# Altium schematic sheet FPGA.schdoc
size 594 x 421 mm; Symbol: Sheet-Symbol_A4; Company: 嘉立创EDA; Version: V1.0; Page Size: A4; @Project Name: prj_extend_and_core_board_7_8; @Page Count: 7; @Update Date: 2024-08-14; @Create Date: 2024-08-09; @Schematic Name: Schematic1; @Page No: 5; @Page Name: FPGA; Device: Sheet-Symbol_A4; @Board Name: Core_Board; @Create Time: 14:20:36; @Update Time: 14:21:04
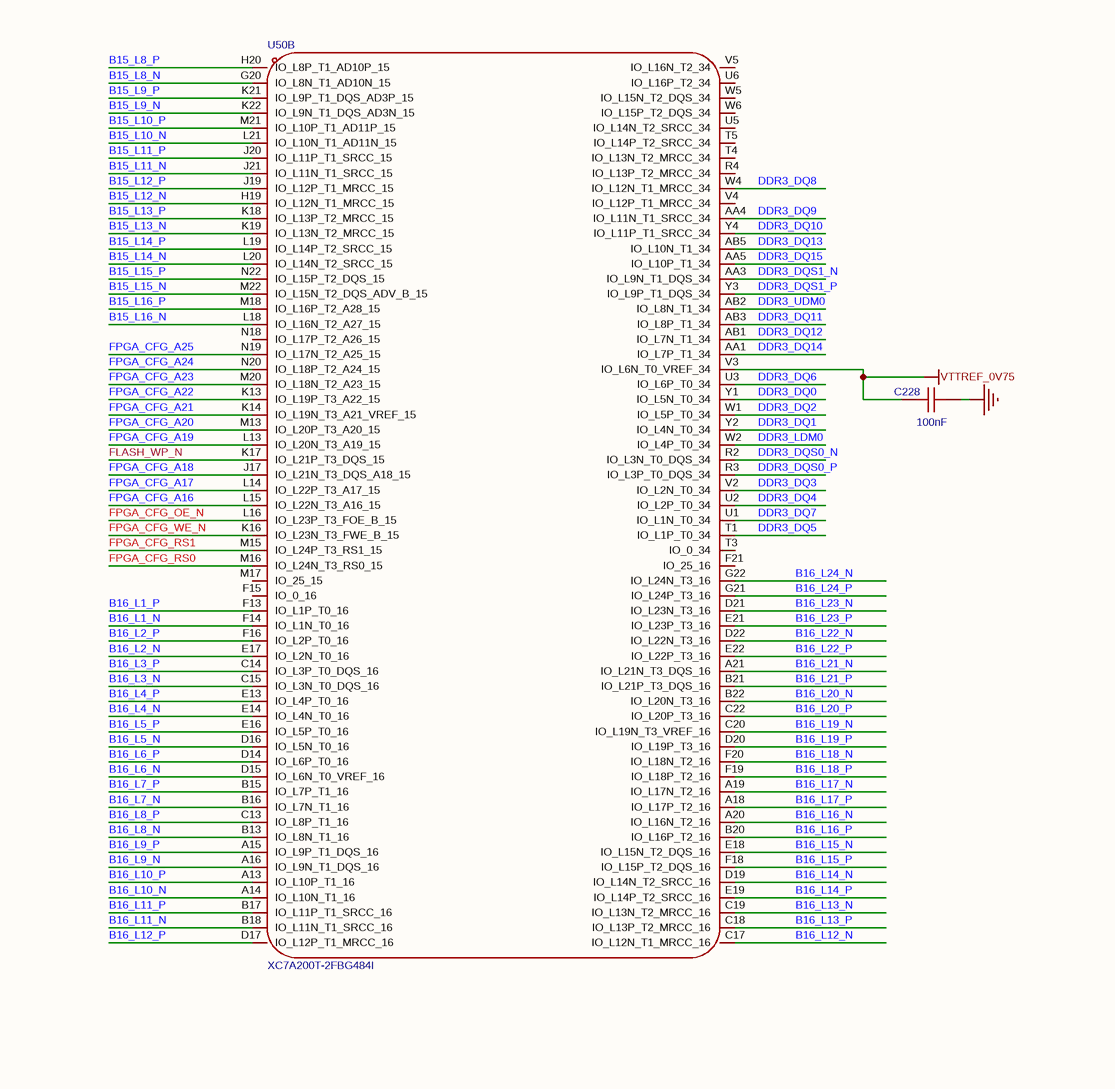
[diagram p0: FPGA.schdoc, top left]
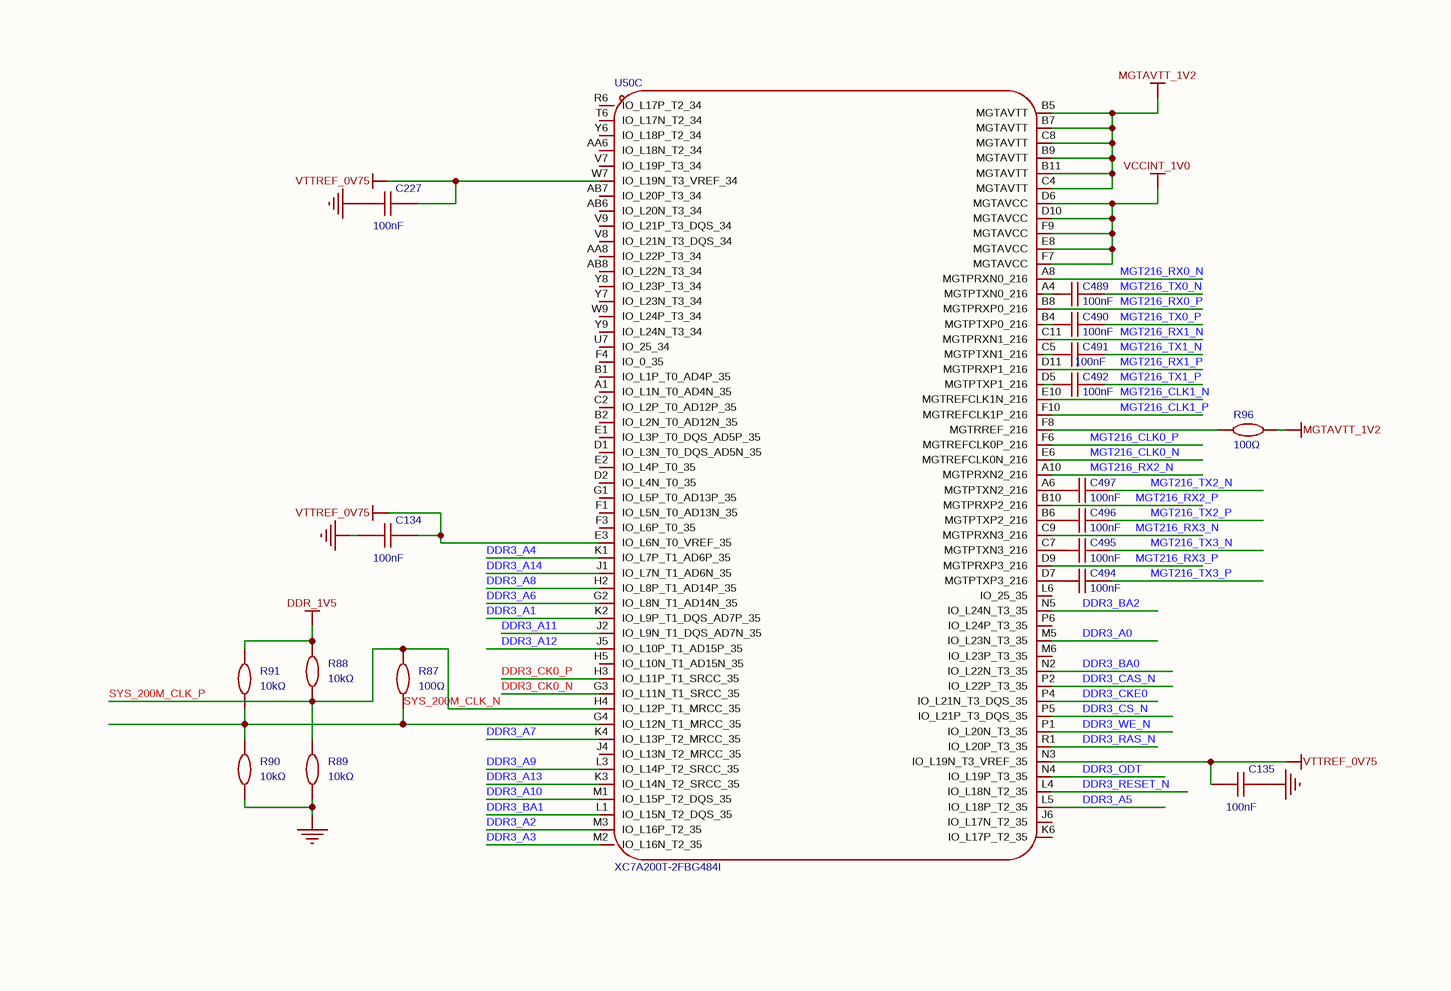
[diagram p1: FPGA.schdoc, top right]
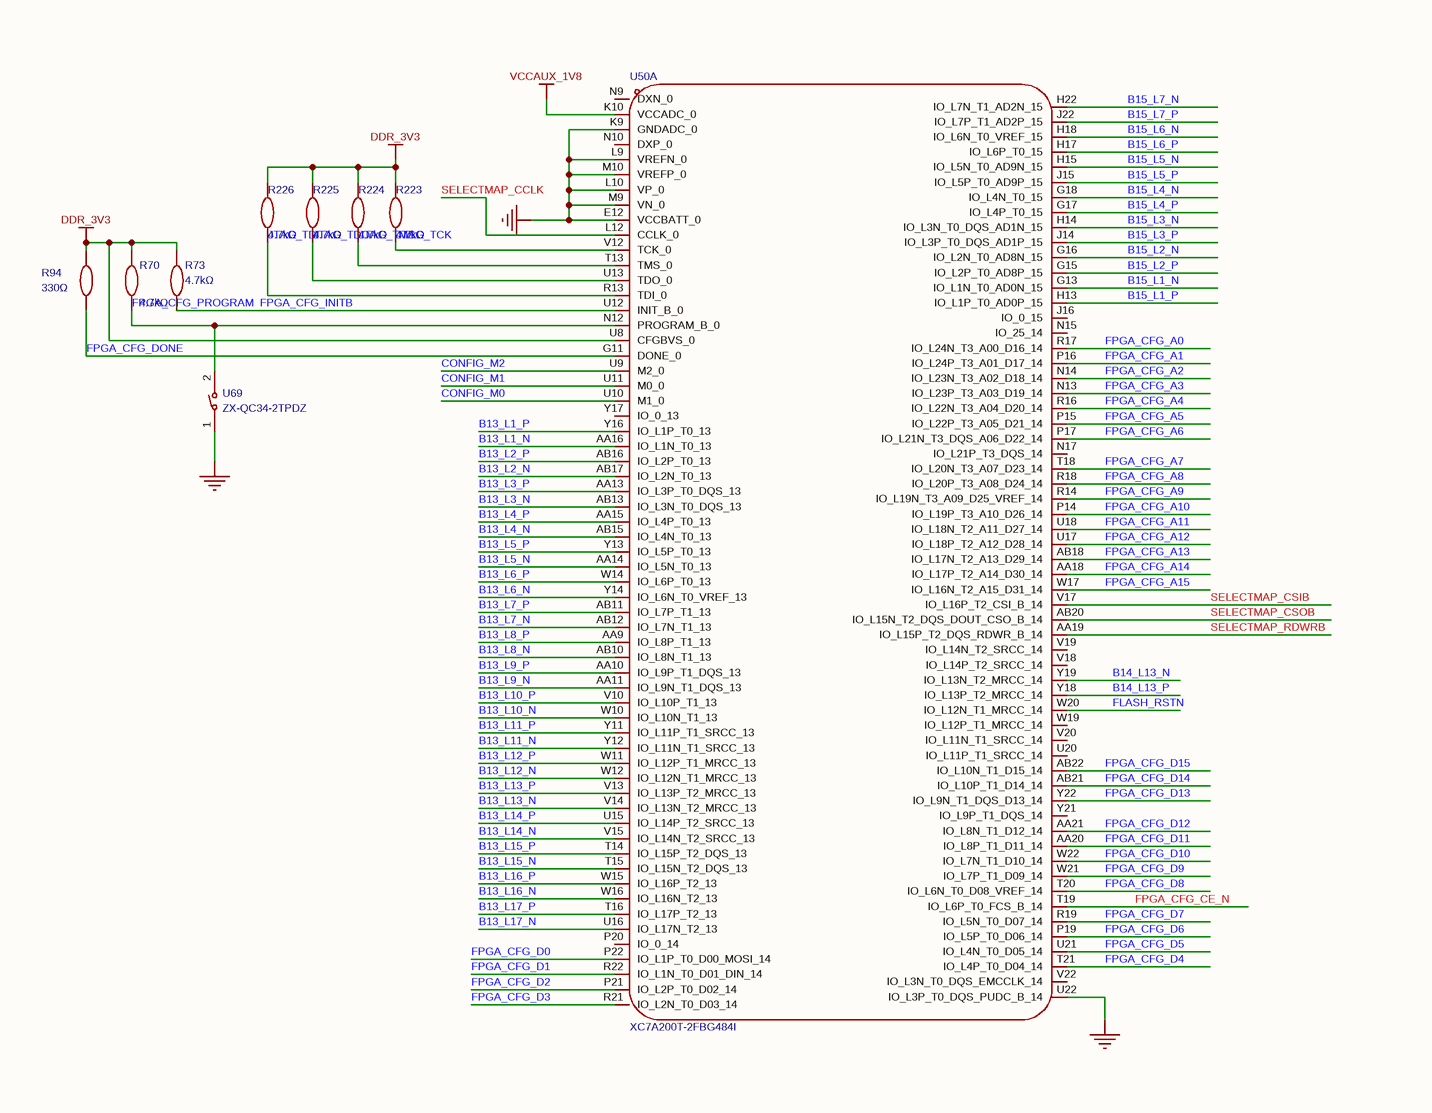
[diagram p2: FPGA.schdoc, bottom left]
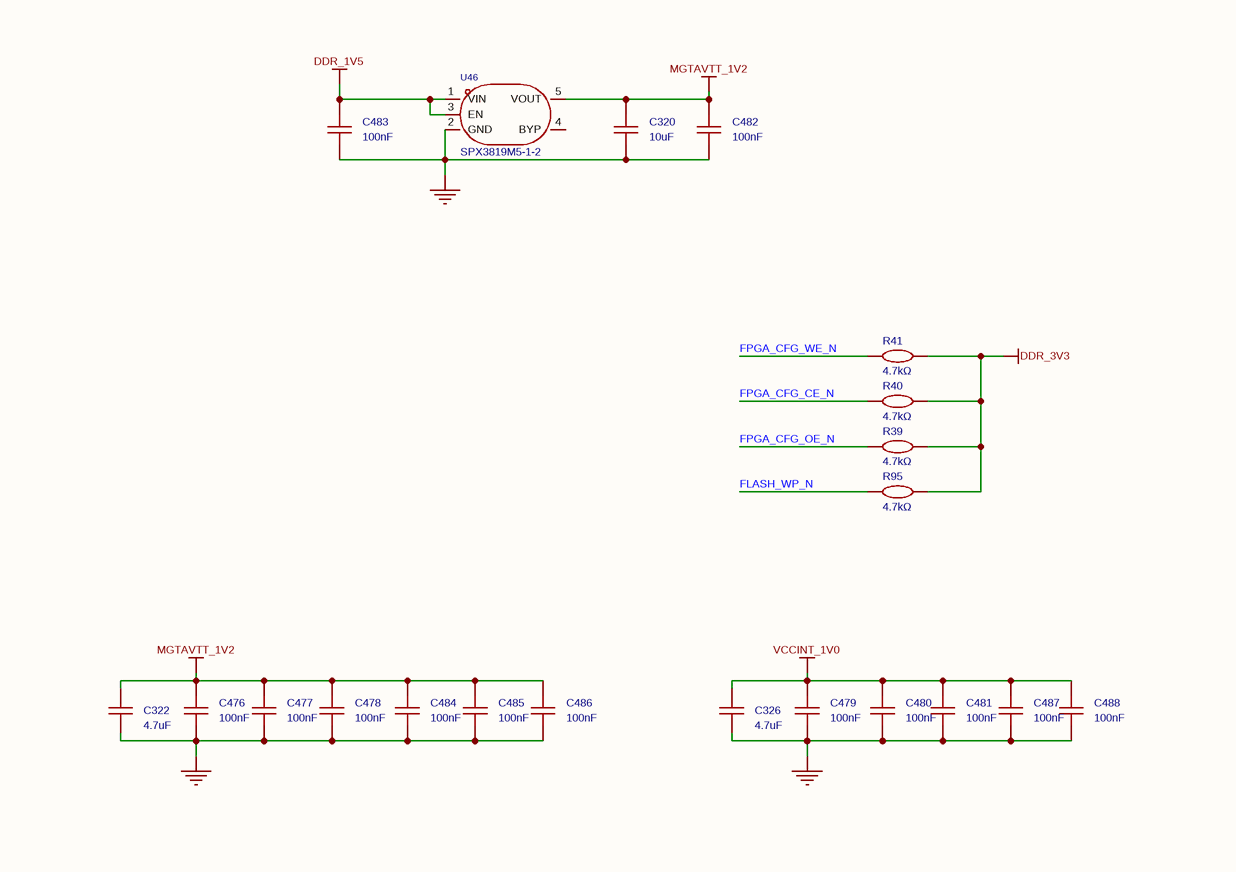
[diagram p3: FPGA.schdoc, bottom right]

## Parts
C134  100nF  [C0402]
C135  100nF  [C0402]
C227  100nF  [C0402]
C228  100nF  [C0402]
C320  10uF  [C0603]
C322  4.7uF  [C0603]
C326  4.7uF  [C0603]
C476  100nF  [C0402]
C477  100nF  [C0402]
C478  100nF  [C0402]
C479  100nF  [C0402]
C480  100nF  [C0402]
C481  100nF  [C0402]
C482  100nF  [C0402]
C483  100nF  [C0402]
C484  100nF  [C0402]
C485  100nF  [C0402]
C486  100nF  [C0402]
C487  100nF  [C0402]
C488  100nF  [C0402]
C489  100nF  [C0402]
C490  100nF  [C0402]
C491  100nF  [C0402]
C492  100nF  [C0402]
C494  100nF  [C0402]
C495  100nF  [C0402]
C496  100nF  [C0402]
C497  100nF  [C0402]
R39  4.7kΩ  [R0603]
R40  4.7kΩ  [R0603]
R41  4.7kΩ  [R0603]
R70  4.7kΩ  [R0603]
R73  4.7kΩ  [R0603]
R87  100Ω  [R0603]
R88  10kΩ  [R0603]
R89  10kΩ  [R0603]
R90  10kΩ  [R0603]
R91  10kΩ  [R0603]
R94  330Ω  [R0603]
R95  4.7kΩ  [R0603]
R96  100Ω  [R0402]
R223  4.7kΩ  [R0402]
R224  4.7kΩ  [R0402]
R225  4.7kΩ  [R0402]
R226  4.7kΩ  [R0402]
U46  SPX3819M5-1-2  [SOT-23-5_L2.9-W1.6-P0.95-LS2.8-BR]
U50  XC7A200T-2FBG484I  [FBGA-484_L23.0-W23.0-R22-C22-P1.00-TL]  (parts A,B,C of 5)
U69  ZX-QC34-2TPDZ  [KEY-SMD_L3.9-W3.0-LS5.0-EH]

## Nets
DDR_1V5: C483.2 R88.2 R91.2 U46.1(VIN) U46.3(EN)
DDR_3V3: R39.2 R40.2 R41.2 R70.2 R73.2 R94.2 R95.2 R223.2 R224.2 R225.2 R226.2 U50.U8(CFGBVS_0)
GND: C134.1 C135.2 C227.1 C228.1 C320.1 C322.1 C326.1 C476.1 C477.1 C478.1 C479.1 C480.1 C481.1 C482.1 C483.1 C484.1 C485.1 C486.1 C487.1 C488.1 R89.1 R90.1 U46.2(GND) U50.E12(VCCBATT_0) U50.K9(GNDADC_0) U50.L9(VREFN_0) U50.L10(VP_0) U50.M9(VN_0) U50.M10(VREFP_0) U50.U22(IO_L3P_T0_DQS_PUDC_B_14) U69.1
MGTAVTT_1V2: C320.2 C322.2 C476.2 C477.2 C478.2 C482.2 C484.2 C485.2 C486.2 R96.2 U46.5(VOUT) U50.B5(MGTAVTT) U50.B7(MGTAVTT) U50.B9(MGTAVTT) U50.B11(MGTAVTT) U50.C4(MGTAVTT) U50.C8(MGTAVTT)
VCCAUX_1V8: U50.K10(VCCADC_0)
VCCINT_1V0: C326.2 C479.2 C480.2 C481.2 C487.2 C488.2 U50.D6(MGTAVCC) U50.D10(MGTAVCC) U50.E8(MGTAVCC) U50.F7(MGTAVCC) U50.F9(MGTAVCC)
VTTREF_0V75: C134.2 C135.1 C227.2 C228.2 U50.E3(IO_L6N_T0_VREF_35) U50.N3(IO_L19N_T3_VREF_35) U50.V3(IO_L6N_T0_VREF_34) U50.W7(IO_L19N_T3_VREF_34)
B13_L1_N: U50.AA16(IO_L1N_T0_13)
B13_L1_P: U50.Y16(IO_L1P_T0_13)
B13_L2_N: U50.AB17(IO_L2N_T0_13)
B13_L2_P: U50.AB16(IO_L2P_T0_13)
B13_L3_N: U50.AB13(IO_L3N_T0_DQS_13)
B13_L3_P: U50.AA13(IO_L3P_T0_DQS_13)
B13_L4_N: U50.AB15(IO_L4N_T0_13)
B13_L4_P: U50.AA15(IO_L4P_T0_13)
B13_L5_N: U50.AA14(IO_L5N_T0_13)
B13_L5_P: U50.Y13(IO_L5P_T0_13)
B13_L6_N: U50.Y14(IO_L6N_T0_VREF_13)
B13_L6_P: U50.W14(IO_L6P_T0_13)
B13_L7_N: U50.AB12(IO_L7N_T1_13)
B13_L7_P: U50.AB11(IO_L7P_T1_13)
B13_L8_N: U50.AB10(IO_L8N_T1_13)
B13_L8_P: U50.AA9(IO_L8P_T1_13)
B13_L9_N: U50.AA11(IO_L9N_T1_DQS_13)
B13_L9_P: U50.AA10(IO_L9P_T1_DQS_13)
B13_L10_N: U50.W10(IO_L10N_T1_13)
B13_L10_P: U50.V10(IO_L10P_T1_13)
B13_L11_N: U50.Y12(IO_L11N_T1_SRCC_13)
B13_L11_P: U50.Y11(IO_L11P_T1_SRCC_13)
B13_L12_N: U50.W12(IO_L12N_T1_MRCC_13)
B13_L12_P: U50.W11(IO_L12P_T1_MRCC_13)
B13_L13_N: U50.V14(IO_L13N_T2_MRCC_13)
B13_L13_P: U50.V13(IO_L13P_T2_MRCC_13)
B13_L14_N: U50.V15(IO_L14N_T2_SRCC_13)
B13_L14_P: U50.U15(IO_L14P_T2_SRCC_13)
B13_L15_N: U50.T15(IO_L15N_T2_DQS_13)
B13_L15_P: U50.T14(IO_L15P_T2_DQS_13)
B13_L16_N: U50.W16(IO_L16N_T2_13)
B13_L16_P: U50.W15(IO_L16P_T2_13)
B13_L17_N: U50.U16(IO_L17N_T2_13)
B13_L17_P: U50.T16(IO_L17P_T2_13)
B14_L13_N: U50.Y19(IO_L13N_T2_MRCC_14)
B14_L13_P: U50.Y18(IO_L13P_T2_MRCC_14)
B15_L1_N: U50.G13(IO_L1N_T0_AD0N_15)
B15_L1_P: U50.H13(IO_L1P_T0_AD0P_15)
B15_L2_N: U50.G16(IO_L2N_T0_AD8N_15)
B15_L2_P: U50.G15(IO_L2P_T0_AD8P_15)
B15_L3_N: U50.H14(IO_L3N_T0_DQS_AD1N_15)
B15_L3_P: U50.J14(IO_L3P_T0_DQS_AD1P_15)
B15_L4_N: U50.G18(IO_L4N_T0_15)
B15_L4_P: U50.G17(IO_L4P_T0_15)
B15_L5_N: U50.H15(IO_L5N_T0_AD9N_15)
B15_L5_P: U50.J15(IO_L5P_T0_AD9P_15)
B15_L6_N: U50.H18(IO_L6N_T0_VREF_15)
B15_L6_P: U50.H17(IO_L6P_T0_15)
B15_L7_N: U50.H22(IO_L7N_T1_AD2N_15)
B15_L7_P: U50.J22(IO_L7P_T1_AD2P_15)
B15_L8_N: U50.G20(IO_L8N_T1_AD10N_15)
B15_L8_P: U50.H20(IO_L8P_T1_AD10P_15)
B15_L9_N: U50.K22(IO_L9N_T1_DQS_AD3N_15)
B15_L9_P: U50.K21(IO_L9P_T1_DQS_AD3P_15)
B15_L10_N: U50.L21(IO_L10N_T1_AD11N_15)
B15_L10_P: U50.M21(IO_L10P_T1_AD11P_15)
B15_L11_N: U50.J21(IO_L11N_T1_SRCC_15)
B15_L11_P: U50.J20(IO_L11P_T1_SRCC_15)
B15_L12_N: U50.H19(IO_L12N_T1_MRCC_15)
B15_L12_P: U50.J19(IO_L12P_T1_MRCC_15)
B15_L13_N: U50.K19(IO_L13N_T2_MRCC_15)
B15_L13_P: U50.K18(IO_L13P_T2_MRCC_15)
B15_L14_N: U50.L20(IO_L14N_T2_SRCC_15)
B15_L14_P: U50.L19(IO_L14P_T2_SRCC_15)
B15_L15_N: U50.M22(IO_L15N_T2_DQS_ADV_B_15)
B15_L15_P: U50.N22(IO_L15P_T2_DQS_15)
B15_L16_N: U50.L18(IO_L16N_T2_A27_15)
B15_L16_P: U50.M18(IO_L16P_T2_A28_15)
B16_L1_N: U50.F14(IO_L1N_T0_16)
B16_L1_P: U50.F13(IO_L1P_T0_16)
B16_L2_N: U50.E17(IO_L2N_T0_16)
B16_L2_P: U50.F16(IO_L2P_T0_16)
B16_L3_N: U50.C15(IO_L3N_T0_DQS_16)
B16_L3_P: U50.C14(IO_L3P_T0_DQS_16)
B16_L4_N: U50.E14(IO_L4N_T0_16)
B16_L4_P: U50.E13(IO_L4P_T0_16)
B16_L5_N: U50.D16(IO_L5N_T0_16)
B16_L5_P: U50.E16(IO_L5P_T0_16)
B16_L6_N: U50.D15(IO_L6N_T0_VREF_16)
B16_L6_P: U50.D14(IO_L6P_T0_16)
B16_L7_N: U50.B16(IO_L7N_T1_16)
B16_L7_P: U50.B15(IO_L7P_T1_16)
B16_L8_N: U50.B13(IO_L8N_T1_16)
B16_L8_P: U50.C13(IO_L8P_T1_16)
B16_L9_N: U50.A16(IO_L9N_T1_DQS_16)
B16_L9_P: U50.A15(IO_L9P_T1_DQS_16)
B16_L10_N: U50.A14(IO_L10N_T1_16)
B16_L10_P: U50.A13(IO_L10P_T1_16)
B16_L11_N: U50.B18(IO_L11N_T1_SRCC_16)
B16_L11_P: U50.B17(IO_L11P_T1_SRCC_16)
B16_L12_N: U50.C17(IO_L12N_T1_MRCC_16)
B16_L12_P: U50.D17(IO_L12P_T1_MRCC_16)
B16_L13_N: U50.C19(IO_L13N_T2_MRCC_16)
B16_L13_P: U50.C18(IO_L13P_T2_MRCC_16)
B16_L14_N: U50.D19(IO_L14N_T2_SRCC_16)
B16_L14_P: U50.E19(IO_L14P_T2_SRCC_16)
B16_L15_N: U50.E18(IO_L15N_T2_DQS_16)
B16_L15_P: U50.F18(IO_L15P_T2_DQS_16)
B16_L16_N: U50.A20(IO_L16N_T2_16)
B16_L16_P: U50.B20(IO_L16P_T2_16)
B16_L17_N: U50.A19(IO_L17N_T2_16)
B16_L17_P: U50.A18(IO_L17P_T2_16)
B16_L18_N: U50.F20(IO_L18N_T2_16)
B16_L18_P: U50.F19(IO_L18P_T2_16)
B16_L19_N: U50.C20(IO_L19N_T3_VREF_16)
B16_L19_P: U50.D20(IO_L19P_T3_16)
B16_L20_N: U50.B22(IO_L20N_T3_16)
B16_L20_P: U50.C22(IO_L20P_T3_16)
B16_L21_N: U50.A21(IO_L21N_T3_DQS_16)
B16_L21_P: U50.B21(IO_L21P_T3_DQS_16)
B16_L22_N: U50.D22(IO_L22N_T3_16)
B16_L22_P: U50.E22(IO_L22P_T3_16)
B16_L23_N: U50.D21(IO_L23N_T3_16)
B16_L23_P: U50.E21(IO_L23P_T3_16)
B16_L24_N: U50.G22(IO_L24N_T3_16)
B16_L24_P: U50.G21(IO_L24P_T3_16)
CONFIG_M0: U50.U10(M1_0)
CONFIG_M1: U50.U11(M0_0)
CONFIG_M2: U50.U9(M2_0)
DDR3_A0: U50.M5(IO_L23N_T3_35)
DDR3_A1: U50.K2(IO_L9P_T1_DQS_AD7P_35)
DDR3_A2: U50.M3(IO_L16P_T2_35)
DDR3_A3: U50.M2(IO_L16N_T2_35)
DDR3_A4: U50.K1(IO_L7P_T1_AD6P_35)
DDR3_A5: U50.L5(IO_L18P_T2_35)
DDR3_A6: U50.G2(IO_L8N_T1_AD14N_35)
DDR3_A7: U50.K4(IO_L13P_T2_MRCC_35)
DDR3_A8: U50.H2(IO_L8P_T1_AD14P_35)
DDR3_A9: U50.L3(IO_L14P_T2_SRCC_35)
DDR3_A10: U50.M1(IO_L15P_T2_DQS_35)
DDR3_A11: U50.J2(IO_L9N_T1_DQS_AD7N_35)
DDR3_A12: U50.J5(IO_L10P_T1_AD15P_35)
DDR3_A13: U50.K3(IO_L14N_T2_SRCC_35)
DDR3_A14: U50.J1(IO_L7N_T1_AD6N_35)
DDR3_BA0: U50.N2(IO_L22N_T3_35)
DDR3_BA1: U50.L1(IO_L15N_T2_DQS_35)
DDR3_BA2: U50.N5(IO_L24N_T3_35)
DDR3_CAS_N: U50.P2(IO_L22P_T3_35)
DDR3_CK0_N: U50.G3(IO_L11N_T1_SRCC_35)
DDR3_CK0_P: U50.H3(IO_L11P_T1_SRCC_35)
DDR3_CKE0: U50.P4(IO_L21N_T3_DQS_35)
DDR3_CS_N: U50.P5(IO_L21P_T3_DQS_35)
DDR3_DQ0: U50.Y1(IO_L5N_T0_34)
DDR3_DQ1: U50.Y2(IO_L4N_T0_34)
DDR3_DQ2: U50.W1(IO_L5P_T0_34)
DDR3_DQ3: U50.V2(IO_L2N_T0_34)
DDR3_DQ4: U50.U2(IO_L2P_T0_34)
DDR3_DQ5: U50.T1(IO_L1P_T0_34)
DDR3_DQ6: U50.U3(IO_L6P_T0_34)
DDR3_DQ7: U50.U1(IO_L1N_T0_34)
DDR3_DQ8: U50.W4(IO_L12N_T1_MRCC_34)
DDR3_DQ9: U50.AA4(IO_L11N_T1_SRCC_34)
DDR3_DQ10: U50.Y4(IO_L11P_T1_SRCC_34)
DDR3_DQ11: U50.AB3(IO_L8P_T1_34)
DDR3_DQ12: U50.AB1(IO_L7N_T1_34)
DDR3_DQ13: U50.AB5(IO_L10N_T1_34)
DDR3_DQ14: U50.AA1(IO_L7P_T1_34)
DDR3_DQ15: U50.AA5(IO_L10P_T1_34)
DDR3_DQS0_N: U50.R2(IO_L3N_T0_DQS_34)
DDR3_DQS0_P: U50.R3(IO_L3P_T0_DQS_34)
DDR3_DQS1_N: U50.AA3(IO_L9N_T1_DQS_34)
DDR3_DQS1_P: U50.Y3(IO_L9P_T1_DQS_34)
DDR3_LDM0: U50.W2(IO_L4P_T0_34)
DDR3_ODT: U50.N4(IO_L19P_T3_35)
DDR3_RAS_N: U50.R1(IO_L20P_T3_35)
DDR3_RESET_N: U50.L4(IO_L18N_T2_35)
DDR3_UDM0: U50.AB2(IO_L8N_T1_34)
DDR3_WE_N: U50.P1(IO_L20N_T3_35)
FLASH_RSTN: U50.W20(IO_L12N_T1_MRCC_14)
FLASH_WP_N: R95.1 U50.K17(IO_L21P_T3_DQS_15)
FPGA_CFG_A0: U50.R17(IO_L24N_T3_A00_D16_14)
FPGA_CFG_A1: U50.P16(IO_L24P_T3_A01_D17_14)
FPGA_CFG_A2: U50.N14(IO_L23N_T3_A02_D18_14)
FPGA_CFG_A3: U50.N13(IO_L23P_T3_A03_D19_14)
FPGA_CFG_A4: U50.R16(IO_L22N_T3_A04_D20_14)
FPGA_CFG_A5: U50.P15(IO_L22P_T3_A05_D21_14)
FPGA_CFG_A6: U50.P17(IO_L21N_T3_DQS_A06_D22_14)
FPGA_CFG_A7: U50.T18(IO_L20N_T3_A07_D23_14)
FPGA_CFG_A8: U50.R18(IO_L20P_T3_A08_D24_14)
FPGA_CFG_A9: U50.R14(IO_L19N_T3_A09_D25_VREF_14)
FPGA_CFG_A10: U50.P14(IO_L19P_T3_A10_D26_14)
FPGA_CFG_A11: U50.U18(IO_L18N_T2_A11_D27_14)
FPGA_CFG_A12: U50.U17(IO_L18P_T2_A12_D28_14)
FPGA_CFG_A13: U50.AB18(IO_L17N_T2_A13_D29_14)
FPGA_CFG_A14: U50.AA18(IO_L17P_T2_A14_D30_14)
FPGA_CFG_A15: U50.W17(IO_L16N_T2_A15_D31_14)
FPGA_CFG_A16: U50.L15(IO_L22N_T3_A16_15)
FPGA_CFG_A17: U50.L14(IO_L22P_T3_A17_15)
FPGA_CFG_A18: U50.J17(IO_L21N_T3_DQS_A18_15)
FPGA_CFG_A19: U50.L13(IO_L20N_T3_A19_15)
FPGA_CFG_A20: U50.M13(IO_L20P_T3_A20_15)
FPGA_CFG_A21: U50.K14(IO_L19N_T3_A21_VREF_15)
FPGA_CFG_A22: U50.K13(IO_L19P_T3_A22_15)
FPGA_CFG_A23: U50.M20(IO_L18N_T2_A23_15)
FPGA_CFG_A24: U50.N20(IO_L18P_T2_A24_15)
FPGA_CFG_A25: U50.N19(IO_L17N_T2_A25_15)
FPGA_CFG_CE_N: R40.1 U50.T19(IO_L6P_T0_FCS_B_14)
FPGA_CFG_D0: U50.P22(IO_L1P_T0_D00_MOSI_14)
FPGA_CFG_D1: U50.R22(IO_L1N_T0_D01_DIN_14)
FPGA_CFG_D2: U50.P21(IO_L2P_T0_D02_14)
FPGA_CFG_D3: U50.R21(IO_L2N_T0_D03_14)
FPGA_CFG_D4: U50.T21(IO_L4P_T0_D04_14)
FPGA_CFG_D5: U50.U21(IO_L4N_T0_D05_14)
FPGA_CFG_D6: U50.P19(IO_L5P_T0_D06_14)
FPGA_CFG_D7: U50.R19(IO_L5N_T0_D07_14)
FPGA_CFG_D8: U50.T20(IO_L6N_T0_D08_VREF_14)
FPGA_CFG_D9: U50.W21(IO_L7P_T1_D09_14)
FPGA_CFG_D10: U50.W22(IO_L7N_T1_D10_14)
FPGA_CFG_D11: U50.AA20(IO_L8P_T1_D11_14)
FPGA_CFG_D12: U50.AA21(IO_L8N_T1_D12_14)
FPGA_CFG_D13: U50.Y22(IO_L9N_T1_DQS_D13_14)
FPGA_CFG_D14: U50.AB21(IO_L10P_T1_D14_14)
FPGA_CFG_D15: U50.AB22(IO_L10N_T1_D15_14)
FPGA_CFG_DONE: R94.1 U50.G11(DONE_0)
FPGA_CFG_INITB: R73.1 U50.U12(INIT_B_0)
FPGA_CFG_OE_N: R39.1 U50.L16(IO_L23P_T3_FOE_B_15)
FPGA_CFG_PROGRAM: R70.1 U50.N12(PROGRAM_B_0) U69.2
FPGA_CFG_RS0: U50.M16(IO_L24N_T3_RS0_15)
FPGA_CFG_RS1: U50.M15(IO_L24P_T3_RS1_15)
FPGA_CFG_WE_N: R41.1 U50.K16(IO_L23N_T3_FWE_B_15)
JTAG_TCK: R223.1 U50.V12(TCK_0)
JTAG_TDI: R226.1 U50.R13(TDI_0)
JTAG_TDO: R225.1 U50.U13(TDO_0)
JTAG_TMS: R224.1 U50.T13(TMS_0)
MGT216_CLK0_N: U50.E6(MGTREFCLK0N_216)
MGT216_CLK0_P: U50.F6(MGTREFCLK0P_216)
MGT216_CLK1_N: U50.E10(MGTREFCLK1N_216)
MGT216_CLK1_P: U50.F10(MGTREFCLK1P_216)
MGT216_RX0_N: U50.A8(MGTPRXN0_216)
MGT216_RX0_P: U50.B8(MGTPRXP0_216)
MGT216_RX1_N: U50.C11(MGTPRXN1_216)
MGT216_RX1_P: U50.D11(MGTPRXP1_216)
MGT216_RX2_N: U50.A10(MGTPRXN2_216)
MGT216_RX2_P: U50.B10(MGTPRXP2_216)
MGT216_RX3_N: U50.C9(MGTPRXN3_216)
MGT216_RX3_P: U50.D9(MGTPRXP3_216)
MGT216_TX0_N: C489.1
MGT216_TX0_P: C490.1
MGT216_TX1_N: C491.1
MGT216_TX1_P: C492.1
MGT216_TX2_N: C497.1
MGT216_TX2_P: C496.1
MGT216_TX3_N: C495.1
MGT216_TX3_P: C494.1
SELECTMAP_CCLK: U50.L12(CCLK_0)
SELECTMAP_CSIB: U50.V17(IO_L16P_T2_CSI_B_14)
SELECTMAP_CSOB: U50.AB20(IO_L15N_T2_DQS_DOUT_CSO_B_14)
SELECTMAP_RDWRB: U50.AA19(IO_L15P_T2_DQS_RDWR_B_14)
SYS_200M_CLK_N: R87.1 R90.2 R91.1 U50.G4(IO_L12N_T1_MRCC_35)
SYS_200M_CLK_P: R87.2 R88.1 R89.2 U50.H4(IO_L12P_T1_MRCC_35)
NetC489_2: C489.2 U50.A4(MGTPTXN0_216)
NetC490_2: C490.2 U50.B4(MGTPTXP0_216)
NetC491_2: C491.2 U50.C5(MGTPTXN1_216)
NetC492_2: C492.2 U50.D5(MGTPTXP1_216)
NetC494_2: C494.2 U50.D7(MGTPTXP3_216)
NetC495_2: C495.2 U50.C7(MGTPTXN3_216)
NetC496_2: C496.2 U50.B6(MGTPTXP2_216)
NetC497_2: C497.2 U50.A6(MGTPTXN2_216)
NetR96_1: R96.1 U50.F8(MGTRREF_216)

Not connected (* = marked no-connect by the designer): U46 4(BYP); U50 A1(IO_L1N_T0_AD4N_35) AA6(IO_L18N_T2_34) AA8(IO_L22P_T3_34) AB6(IO_L20N_T3_34) AB7(IO_L20P_T3_34) AB8(IO_L22N_T3_34) B1(IO_L1P_T0_AD4P_35) B2(IO_L2N_T0_AD12N_35) C2(IO_L2P_T0_AD12P_35) D1(IO_L3N_T0_DQS_AD5N_35) D2(IO_L4N_T0_35) E1(IO_L3P_T0_DQS_AD5P_35) E2(IO_L4P_T0_35) F1(IO_L5N_T0_AD13N_35) F3(IO_L6P_T0_35) F4(IO_0_35) F15(IO_0_16) F21(IO_25_16) G1(IO_L5P_T0_AD13P_35) H5(IO_L10N_T1_AD15N_35) J4(IO_L13N_T2_MRCC_35) J6(IO_L17N_T2_35) J16(IO_0_15) K6(IO_L17P_T2_35) L6(IO_25_35) M6(IO_L23P_T3_35) M17(IO_25_15) N9(DXN_0) N10(DXP_0) N15(IO_25_14) N17(IO_L21P_T3_DQS_14) N18(IO_L17P_T2_A26_15) P6(IO_L24P_T3_35) P20(IO_0_14) R4(IO_L13P_T2_MRCC_34) R6(IO_L17P_T2_34) T3(IO_0_34) T4(IO_L13N_T2_MRCC_34) T5(IO_L14P_T2_SRCC_34) T6(IO_L17N_T2_34) U5(IO_L14N_T2_SRCC_34) U6(IO_L16P_T2_34) U7(IO_25_34) U20(IO_L11P_T1_SRCC_14) V4(IO_L12P_T1_MRCC_34) V5(IO_L16N_T2_34) V7(IO_L19P_T3_34) V8(IO_L21N_T3_DQS_34) V9(IO_L21P_T3_DQS_34) V18(IO_L14P_T2_SRCC_14) V19(IO_L14N_T2_SRCC_14) V20(IO_L11N_T1_SRCC_14) V22(IO_L3N_T0_DQS_EMCCLK_14) W5(IO_L15N_T2_DQS_34) W6(IO_L15P_T2_DQS_34) W9(IO_L24P_T3_34) W19(IO_L12P_T1_MRCC_14) Y6(IO_L18P_T2_34) Y7(IO_L23N_T3_34) Y8(IO_L23P_T3_34) Y9(IO_L24N_T3_34) Y17(IO_0_13) Y21(IO_L9P_T1_DQS_14)

## Notes on the sheet
- 1
- 2
- 3
- 4
- 5
- 6
- A
- B
- C
- D
- 更新日期
- 2024-08-14
- 原理图
- 图页
- Schematic1
- FPGA
- 创建日期
- 物料编码
- 2024-08-09
- 审阅
- 绘制
- prj_extend_and_core_board_7_8
- 版本
- V1.0
- 尺寸
- A4
- 页
- 嘉立创EDA
- 共
- 7

## Library data of the parts
C134 C135 C227 C228 C476-C492 C494-C497 = GRM155R71H104KE14D: 容值:100nF;精度:±10%;额定电压:50V;材质(温度系数):X7R;; Manufacturer: muRata(村田); AddInBom: yes; ModelId: 36a51122f27c49738f86b3bfa98863e0; ModelName: C0402_L1.0-W0.5-H0.5; ModelTransform: 39.37,19.685,0,0,0,0,0,0,0; Tolerance: ±10%; Voltage Rated: 50V; Temperature Coefficient: X7R; Symbol: GRM155R71H104KE14D; Device: GRM155R71H104KE14D; Supplier: LCSC; Manufacturer Part: GRM155R71H104KE14D; Value: 100nF; Supplier Part: C77020; JLCPCB Part Class: 扩展库; LCSC Part Name: 100nF ±10% 50V; Supplier Footprint: 0402; Datasheet: https://atta.szlcsc.com/upload/public/pdf/source/20180326/C77020_39BD49C951FF1AF0DB1F1FAC5AC1E401.pdf; ConvertToPcb: yes; FootprintName: C0402
C320 = CL10A106KP8NNNC: 容值:10uF;精度:±10%;额定电压:10V;材质(温度系数):X5R;; Manufacturer: SAMSUNG(三星); AddInBom: yes; ModelId: ac125912035d415993ca9572d50418b1; ModelName: C0603_L1.6-W0.8-H0.8; ModelTransform: 62.992,31.496,0,0,0,0,0,0,0; Tolerance: ±10%; Voltage Rated: 10V; Temperature Coefficient: X5R; Symbol: CL10A106KP8NNNC; Device: CL10A106KP8NNNC; Supplier: LCSC; Manufacturer Part: CL10A106KP8NNNC; Value: 10uF; Supplier Part: C19702; JLCPCB Part Class: 基础库; LCSC Part Name: 10uF ±10% 10V; Supplier Footprint: 0603; Datasheet: https://atta.szlcsc.com/upload/public/pdf/source/20160218/1457707763339.pdf; ConvertToPcb: yes; FootprintName: C0603
C322 C326 = CL10A475KO8NNNC: 容值:4.7uF;精度:±10%;额定电压:16V;材质(温度系数):X5R;; Manufacturer: SAMSUNG(三星); AddInBom: yes; ModelId: ac125912035d415993ca9572d50418b1; ModelName: C0603_L1.6-W0.8-H0.8; ModelTransform: 62.992,31.496,0,0,0,0,0,0,0; Tolerance: ±10%; Voltage Rated: 16V; Temperature Coefficient: X5R; Symbol: CL10A475KO8NNNC; Device: CL10A475KO8NNNC; Supplier: LCSC; Manufacturer Part: CL10A475KO8NNNC; Value: 4.7uF; Supplier Part: C19666; JLCPCB Part Class: 基础库; LCSC Part Name: 4.7uF ±10% 16V; Supplier Footprint: 0603; Datasheet: https://atta.szlcsc.com/upload/public/pdf/source/20160218/1457707763339.pdf; ConvertToPcb: yes; FootprintName: C0603
R39-R41 R70 R73 R95 = 0603WAF4701T5E: 电阻类型:厚膜电阻;阻值:4.7kΩ;精度:±1%;功率:100mW;最大工作电压:75V;温度系数:±100ppm/℃;; Manufacturer: UNI-ROYAL(厚声); AddInBom: yes; ModelId: fc143cca1e79419f9cd78b61e9279f08; ModelTransform: 31.8897,63.7794,0,90,0,0,0,0,0; Tolerance: ±1%; Power(Watts): 100mW; Overload Voltage (Max): 75V; Symbol: 0603WAF4701T5E; Device: 0603WAF4701T5E; Supplier: LCSC; Manufacturer Part: 0603WAF4701T5E; Supplier Part: C23162; Value: 4.7kΩ; JLCPCB Part Class: 基础库; LCSC Part Name: 4.7kΩ ±1% 100mW 厚膜电阻; Supplier Footprint: 0603; Datasheet: https://atta.szlcsc.com/upload/public/pdf/source/20200306/C422600_1E6D84923E4A46A82E41ADD87F860B5C.pdf; ConvertToPcb: yes; FootprintName: R0603; ModelName: R0603; Type: 厚膜电阻; Temperature Coefficient: ±100ppm/℃; Operating Temperature Range: -55℃~+155℃
R87 = 0603WAF1000T5E: 电阻类型:厚膜电阻;阻值:100Ω;精度:±1%;功率:100mW;最大工作电压:75V;温度系数:±200ppm/℃;; Manufacturer: UNI-ROYAL(厚声); AddInBom: yes; ModelId: fc143cca1e79419f9cd78b61e9279f08; ModelTransform: 31.8897,63.7794,0,90,0,0,0,0,0; Tolerance: ±1%; Power(Watts): 100mW; Overload Voltage (Max): 75V; Symbol: 0603WAF1000T5E; Device: 0603WAF1000T5E; LCSC Part Name: 100Ω ±1% 100mW 厚膜电阻; SupplierPart: C22775; ManufacturerPart: 0603WAF1000T5E; Supplier Footprint: 0603; JLCPCB Part Class: 基础库; Datasheet: https://atta.szlcsc.com/upload/public/pdf/source/20200306/C422600_1E6D84923E4A46A82E41ADD87F860B5C.pdf; Supplier: LCSC; ConvertToPcb: yes; FootprintName: R0603; ModelName: R0603; Type: 厚膜电阻; Value: 100Ω; Temperature Coefficient: ±200ppm/℃; Operating Temperature Range: -55℃~+155℃
R88-R91 = 0603WAF1002T5E: 电阻类型:厚膜电阻;阻值:10kΩ;精度:±1%;功率:100mW;最大工作电压:75V;温度系数:±100ppm/℃;; Manufacturer: UNI-ROYAL(厚声); AddInBom: yes; ModelId: fc143cca1e79419f9cd78b61e9279f08; ModelTransform: 31.8897,63.7794,0,90,0,0,0,0,0; Tolerance: ±1%; Power(Watts): 100mW; Overload Voltage (Max): 75V; Symbol: 0603WAF1002T5E; Device: 0603WAF1002T5E; Supplier: LCSC; Manufacturer Part: 0603WAF1002T5E; Supplier Part: C25804; Value: 10kΩ; JLCPCB Part Class: 基础库; LCSC Part Name: 厚膜电阻 10kΩ ±1% 100mW; Supplier Footprint: 0603; Datasheet: https://atta.szlcsc.com/upload/public/pdf/source/20200306/C422600_1E6D84923E4A46A82E41ADD87F860B5C.pdf; ConvertToPcb: yes; FootprintName: R0603; ModelName: R0603; Type: 厚膜电阻; Temperature Coefficient: ±100ppm/℃; Operating Temperature Range: -55℃~+155℃
R94 = 0603WAF3300T5E: 电阻类型:厚膜电阻;阻值:330Ω;精度:±1%;功率:100mW;最大工作电压:75V;温度系数:±100ppm/℃;; Manufacturer: UNI-ROYAL(厚声); AddInBom: yes; ModelId: fc143cca1e79419f9cd78b61e9279f08; ModelTransform: 31.8897,63.7794,0,90,0,0,0,0,0; Tolerance: ±1%; Power(Watts): 100mW; Overload Voltage (Max): 75V; Symbol: 0603WAF3300T5E; Device: 0603WAF3300T5E; Supplier: LCSC; Manufacturer Part: 0603WAF3300T5E; Supplier Part: C23138; Value: 330Ω; JLCPCB Part Class: 基础库; LCSC Part Name: 330Ω ±1% 100mW 厚膜电阻; Supplier Footprint: 0603; Datasheet: https://atta.szlcsc.com/upload/public/pdf/source/20200306/C422600_1E6D84923E4A46A82E41ADD87F860B5C.pdf; ConvertToPcb: yes; FootprintName: R0603; ModelName: R0603; Type: 厚膜电阻; Temperature Coefficient: ±100ppm/℃; Operating Temperature Range: -55℃~+155℃
R96 = 0402WGF1000TCE: 电阻类型:厚膜电阻;阻值:100Ω;精度:±1%;功率:62.5mW;最大工作电压:50V;温度系数:±200ppm/℃;; Manufacturer: UNI-ROYAL(厚声); AddInBom: yes; ModelId: 671aefced39d4c318694bba8bd8efd39; ModelName: R0402_L1.0-W0.5-H0.5; ModelTransform: 39.37,19.685,0,0,0,0,0,0.0005,0; Tolerance: ±1%; Power(Watts): 62.5mW; Overload Voltage (Max): 50V; Symbol: 0402WGF1000TCE; Device: 0402WGF1000TCE; LCSC Part Name: 100Ω ±1% 62.5mW 厚膜电阻; SupplierPart: C25076; ManufacturerPart: 0402WGF1000TCE; Supplier Footprint: 0402; JLCPCB Part Class: 基础库; Datasheet: https://atta.szlcsc.com/upload/public/pdf/source/20200306/C422600_1E6D84923E4A46A82E41ADD87F860B5C.pdf; Supplier: LCSC; ConvertToPcb: yes; FootprintName: R0402; Type: 厚膜电阻; Value: 100Ω; Temperature Coefficient: ±200ppm/℃; Operating Temperature Range: -55℃~+155℃
R223-R226 = 0402WGF4701TCE: 电阻类型:厚膜电阻;阻值:4.7kΩ;精度:±1%;功率:62.5mW;最大工作电压:50V;温度系数:±100ppm/℃;; Manufacturer: UNI-ROYAL(厚声); AddInBom: yes; ModelId: 671aefced39d4c318694bba8bd8efd39; ModelName: R0402_L1.0-W0.5-H0.5; ModelTransform: 39.37,19.685,0,0,0,0,0,0.0005,0; Tolerance: ±1%; Power(Watts): 62.5mW; Overload Voltage (Max): 50V; Symbol: 0402WGF4701TCE; Device: 0402WGF4701TCE; Supplier: LCSC; Manufacturer Part: 0402WGF4701TCE; Supplier Part: C25900; Value: 4.7kΩ; JLCPCB Part Class: 基础库; LCSC Part Name: 4.7kΩ ±1% 62.5mW 厚膜电阻; Supplier Footprint: 0402; Datasheet: https://atta.szlcsc.com/upload/public/pdf/source/20200306/C422600_1E6D84923E4A46A82E41ADD87F860B5C.pdf; ConvertToPcb: yes; FootprintName: R0402; Type: 厚膜电阻; Temperature Coefficient: ±100ppm/℃; Operating Temperature Range: -55℃~+155℃
U46 = SPX3819M5-1-2: Manufacturer: SIPEX; AddInBom: yes; ModelId: 7ba65df16e7b4570af156e925f9c37fe; ModelTransform: 114.173,114.173,0,90,0,0,0,0,0; Symbol: SPX3819M5-1-2; Device: SPX3819M5-1-2; Supplier: LCSC; Supplier Part: C3747366; Manufacturer Part: SPX3819M5-1-2; JLCPCB Part Class: 扩展库; LCSC Part Name: SPX3819M5-1-2; Supplier Footprint: -; Datasheet: https://atta.szlcsc.com/upload/public/pdf/source/20240116/8CAB8B710575AB58F01D2A722F4DB366.pdf; ConvertToPcb: yes; FootprintName: SOT-23-5_L2.9-W1.6-P0.95-LS2.8-BR; ModelName: SOT-23-5_L2.9-W1.6-P0.95-LS2.8-BR
U50 = XC7A200T-2FBG484I: Manufacturer: AMD/XILINX(赛灵思); AddInBom: yes; ModelId: 3abebaa3ee4f462aa6190f543be940e9; ModelTransform: 905.51,905.51,0,0,0,0,0,0,0; JLCPCB Part Class: Extended Part; Symbol: XC7A200T-2FBG484I; Device: XC7A200T-2FBG484I; LCSC Part Name: XC7A200T-2FBG484I -; SupplierPart: C494680; ManufacturerPart: XC7A200T-2FBG484I; Supplier Footprint: FCBGA-484; Datasheet: https://atta.szlcsc.com/upload/public/pdf/source/20200309/C494680_F336422EF4F4583D8575B40FC985FE3D.pdf; Supplier: LCSC; ConvertToPcb: yes; FootprintName: FBGA-484_L23.0-W23.0-R22-C22-P1.00-TL; ModelName: FBGA-484_L23.0-W23.0-R22-C22-P1.00-TL
U69 = ZX-QC34-2TPDZ: 电路结构:单刀单掷;按钮形状:圆形按钮;作用力:2.6N;安装方式:立贴;开关长度:3mm;开关宽度:4mm;开关高度:2mm;带支架:不带;触点电流:50mA;额定电压(AC):250V;额定电压(DC):12V;绝缘电阻:100MΩ;机械寿命:10万次;; Manufacturer: Megastar(兆星); AddInBom: yes; ModelId: 887c37aacc9c4feb87b9442b15e50881; ModelTransform: 196.85,118.5037,0,0,0,0,0,0,-19.685; Circuit: 单刀单掷; Actuator Style: 圆形按钮; Operating Force: 2.6N; Switch Length: 3mm; Switch Width: 4mm; Switch Height: 2mm; Strike Gundam: 不带; Contact Current: 50mA; Voltage Rating (AC): 250V; Voltage Rating (DC): 12V; Insulation Resistance: 100MΩ; Actuator/Cap Color: 黑色; Pin Style: 鸥翼型; Mechanical Life: 10万次; Symbol: ZX-QC34-2TPDZ; Device: ZX-QC34-2TPDZ; LCSC Part Name: 3*4*2贴片开关带柱; SupplierPart: C7470219; ManufacturerPart: ZX-QC34-2TPDZ; Supplier Footprint: SMD; JLCPCB Part Class: 扩展库; Datasheet: https://atta.szlcsc.com/upload/public/pdf/source/20230724/D2731FAADF93973E25928DE23F241F8A.pdf; Supplier: LCSC; ConvertToPcb: yes; FootprintName: KEY-SMD_L3.9-W3.0-LS5.0-EH; ModelName: KEY-SMD_L3.9-W3.0-LS5.0-EH; Mounting Style: 立贴; Operating Temperature: -30℃~+80℃